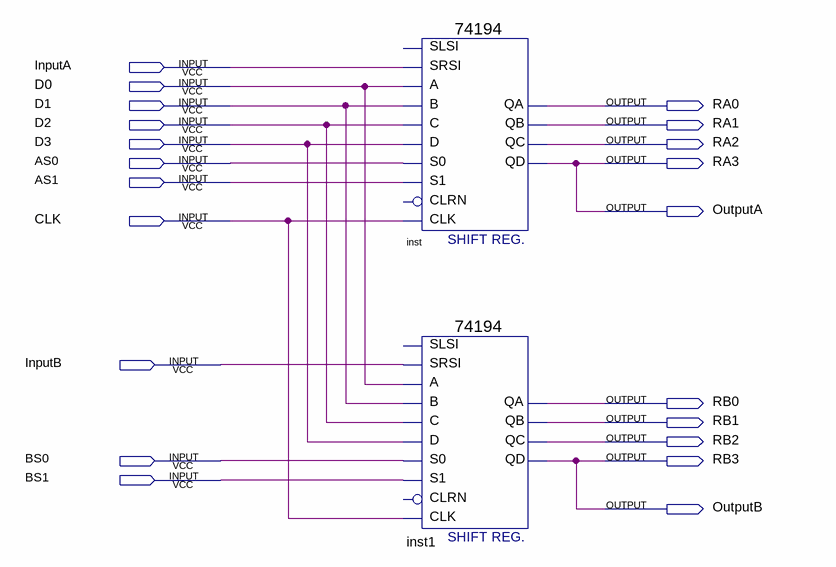
[diagram p0: schematic sheet]
// Quartus schematic RegisterUnit.bdf as structural Verilog: 2 symbols, 21 pins
module RegisterUnit (
  input  InputA,
  input  D0,
  input  D1,
  input  D2,
  input  D3,
  input  AS0,
  input  AS1,
  input  CLK,
  input  InputB,
  input  BS0,
  input  BS1,
  output RA0,
  output RA1,
  output RA2,
  output RA3,
  output OutputA,
  output RB0,
  output RB1,
  output RB2,
  output RB3,
  output OutputB
);

  \74194  inst (
    .SRSI(InputA), .B(D1), .C(D2), .CLK(CLK), .D(D3), .S1(AS1), .S0(AS0), .A(D0), .QA(RA0), .QB(RA1),
    .QC(RA2), .QD(OutputA));  // open: SLSI, CLRN
  \74194  inst1 (
    .SRSI(InputB), .B(D1), .C(D2), .CLK(CLK), .D(D3), .S1(BS1), .S0(BS0), .A(D0), .QA(RB0), .QB(RB1),
    .QC(RB2), .QD(OutputB));  // open: SLSI, CLRN

  assign RA3 = OutputA;
  assign RB3 = OutputB;
endmodule
